# Altium schematic sheet CF1_4W-2.2KΩ±5.schdoc
size 127 x 101 mm
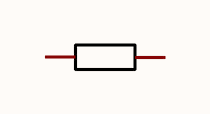
[diagram p0: CF1_4W-2.2KΩ±5.schdoc]

## Parts
R?  CF1/4W-2.2KΩ±5% T  [RES-TH_BD2.3-L6.5-P10.50-D0.5]  (value not drawn)

## Nets

Not connected (* = marked no-connect by the designer): R? 1 2

## Library data of the parts
R? = CF1/4W-2.2KΩ±5% T: Manufacturer: CCO(千志电子); Symbol: CF1/4W-2.2KΩ±5% T52; Add into BOM: yes; Value: 2.2kΩ; Tolerance: ±5%; Overload Voltage (Max): 250V; Power(Watts): 250mW; Temperature Coefficient: ±350ppm/℃; Device: CF1/4W-2.2KΩ±5% T; LCSC Part Name: 2.2kΩ ±5% 250mW 碳膜电阻; Supplier Part: C120063; Manufacturer Part: CF1/4W-2.2KΩ±5% T; Supplier Footprint: 插件,D2.3xL6.5mm; JLCPCB Part Class: Extended Part; Datasheet: https://atta.szlcsc.com/upload/public/pdf/source/20190910/C427328_A0A2D65F3FD547937F4E674C90868175.pdf; Supplier: LCSC; Convert to PCB: yes; Type: Carbon Resister; Operating Temperature Range: -55℃~+155℃